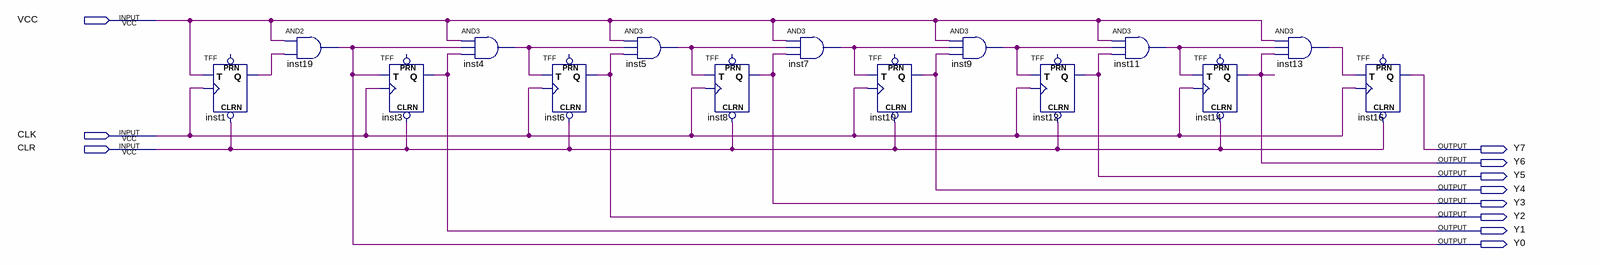
[diagram p0: schematic sheet]
// Quartus schematic counter.bdf as structural Verilog: 15 symbols, 11 pins
module counter (
  input  VCC,
  input  CLK,
  input  CLR,
  output Y7,
  output Y6,
  output Y5,
  output Y4,
  output Y3,
  output Y2,
  output Y1,
  output Y0
);

  wire inst1_q, inst4_out, inst5_out, inst7_out, inst9_out, inst11_out, inst13_out;

  TFF inst1 (.CLRN(CLR), .T(VCC), .CLK(CLK), .Q(inst1_q));  // open: PRN
  and inst19 (Y0, VCC, inst1_q);
  TFF inst3 (.CLRN(CLR), .T(Y0), .CLK(CLK), .Q(Y1));  // open: PRN
  and inst4 (inst4_out, VCC, Y0, Y1);
  TFF inst6 (.CLRN(CLR), .T(inst4_out), .CLK(CLK), .Q(Y2));  // open: PRN
  and inst5 (inst5_out, VCC, inst4_out, Y2);
  TFF inst8 (.CLRN(CLR), .T(inst5_out), .CLK(CLK), .Q(Y3));  // open: PRN
  and inst7 (inst7_out, VCC, inst5_out, Y3);
  TFF inst10 (.CLRN(CLR), .T(inst7_out), .CLK(CLK), .Q(Y4));  // open: PRN
  and inst9 (inst9_out, VCC, inst7_out, Y4);
  TFF inst12 (.CLRN(CLR), .T(inst9_out), .CLK(CLK), .Q(Y5));  // open: PRN
  and inst11 (inst11_out, VCC, inst9_out, Y5);
  TFF inst14 (.CLRN(CLR), .T(inst11_out), .CLK(CLK), .Q(Y6));  // open: PRN
  and inst13 (inst13_out, VCC, inst11_out, Y6);
  TFF inst16 (.CLRN(CLR), .T(inst13_out), .CLK(CLK), .Q(Y7));  // open: PRN
endmodule
